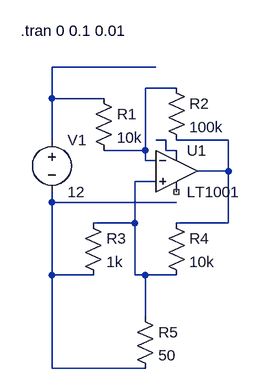
[diagram p0: schematic Draft13.asc]
Draft13.asc, the LTspice schematic file:
Version 4
SHEET 1 880 680
WIRE 304 176 144 176
WIRE 336 208 288 208
WIRE 144 224 144 176
WIRE 224 224 144 224
WIRE 144 288 144 224
WIRE 320 288 304 288
WIRE 416 288 336 288
WIRE 288 304 288 208
WIRE 288 304 224 304
WIRE 320 304 320 288
WIRE 336 304 320 304
WIRE 288 320 288 304
WIRE 304 320 288 320
WIRE 416 336 416 288
WIRE 416 336 368 336
WIRE 304 352 272 352
WIRE 144 384 144 368
WIRE 336 384 144 384
WIRE 272 416 272 352
WIRE 272 416 208 416
WIRE 416 416 416 336
WIRE 416 416 336 416
WIRE 144 496 144 384
WIRE 208 496 144 496
WIRE 272 496 272 416
WIRE 288 496 272 496
WIRE 336 496 288 496
WIRE 288 560 288 496
WIRE 144 640 144 496
WIRE 288 640 144 640
SYMBOL voltage 144 272 R0
SYMATTR InstName V1
SYMATTR Value 12
SYMBOL res 208 208 R0
SYMATTR InstName R1
SYMATTR Value 10k
SYMBOL res 320 192 R0
SYMATTR InstName R2
SYMATTR Value 100k
SYMBOL res 192 400 R0
SYMATTR InstName R3
SYMATTR Value 1k
SYMBOL res 320 400 R0
SYMATTR InstName R4
SYMATTR Value 10k
SYMBOL res 272 544 R0
SYMATTR InstName R5
SYMATTR Value 50
SYMBOL Opamps/LT1001 336 272 R0
SYMATTR InstName U1
TEXT 96 120 Left 2 !.tran 0 0.1 0.01

The netlist it stands for:
* Draft13.asc
V1 N001 N006 12
R1 N001 N002 10k
R2 N002 N004 100k
R3 N005 N006 1k
R4 N004 N005 10k
R5 N005 N006 50
XU1 N005 N002 N003 NC_01 N004 LT1001  ; pins In+ In- V+ V- OUT
.tran 0 0.1 0.01
.lib LTC.lib
.backanno
.end